# EAGLE schematic PMS alpha_v0.1 (EAGLE 9.0.1)

## Sheet 1 of 4
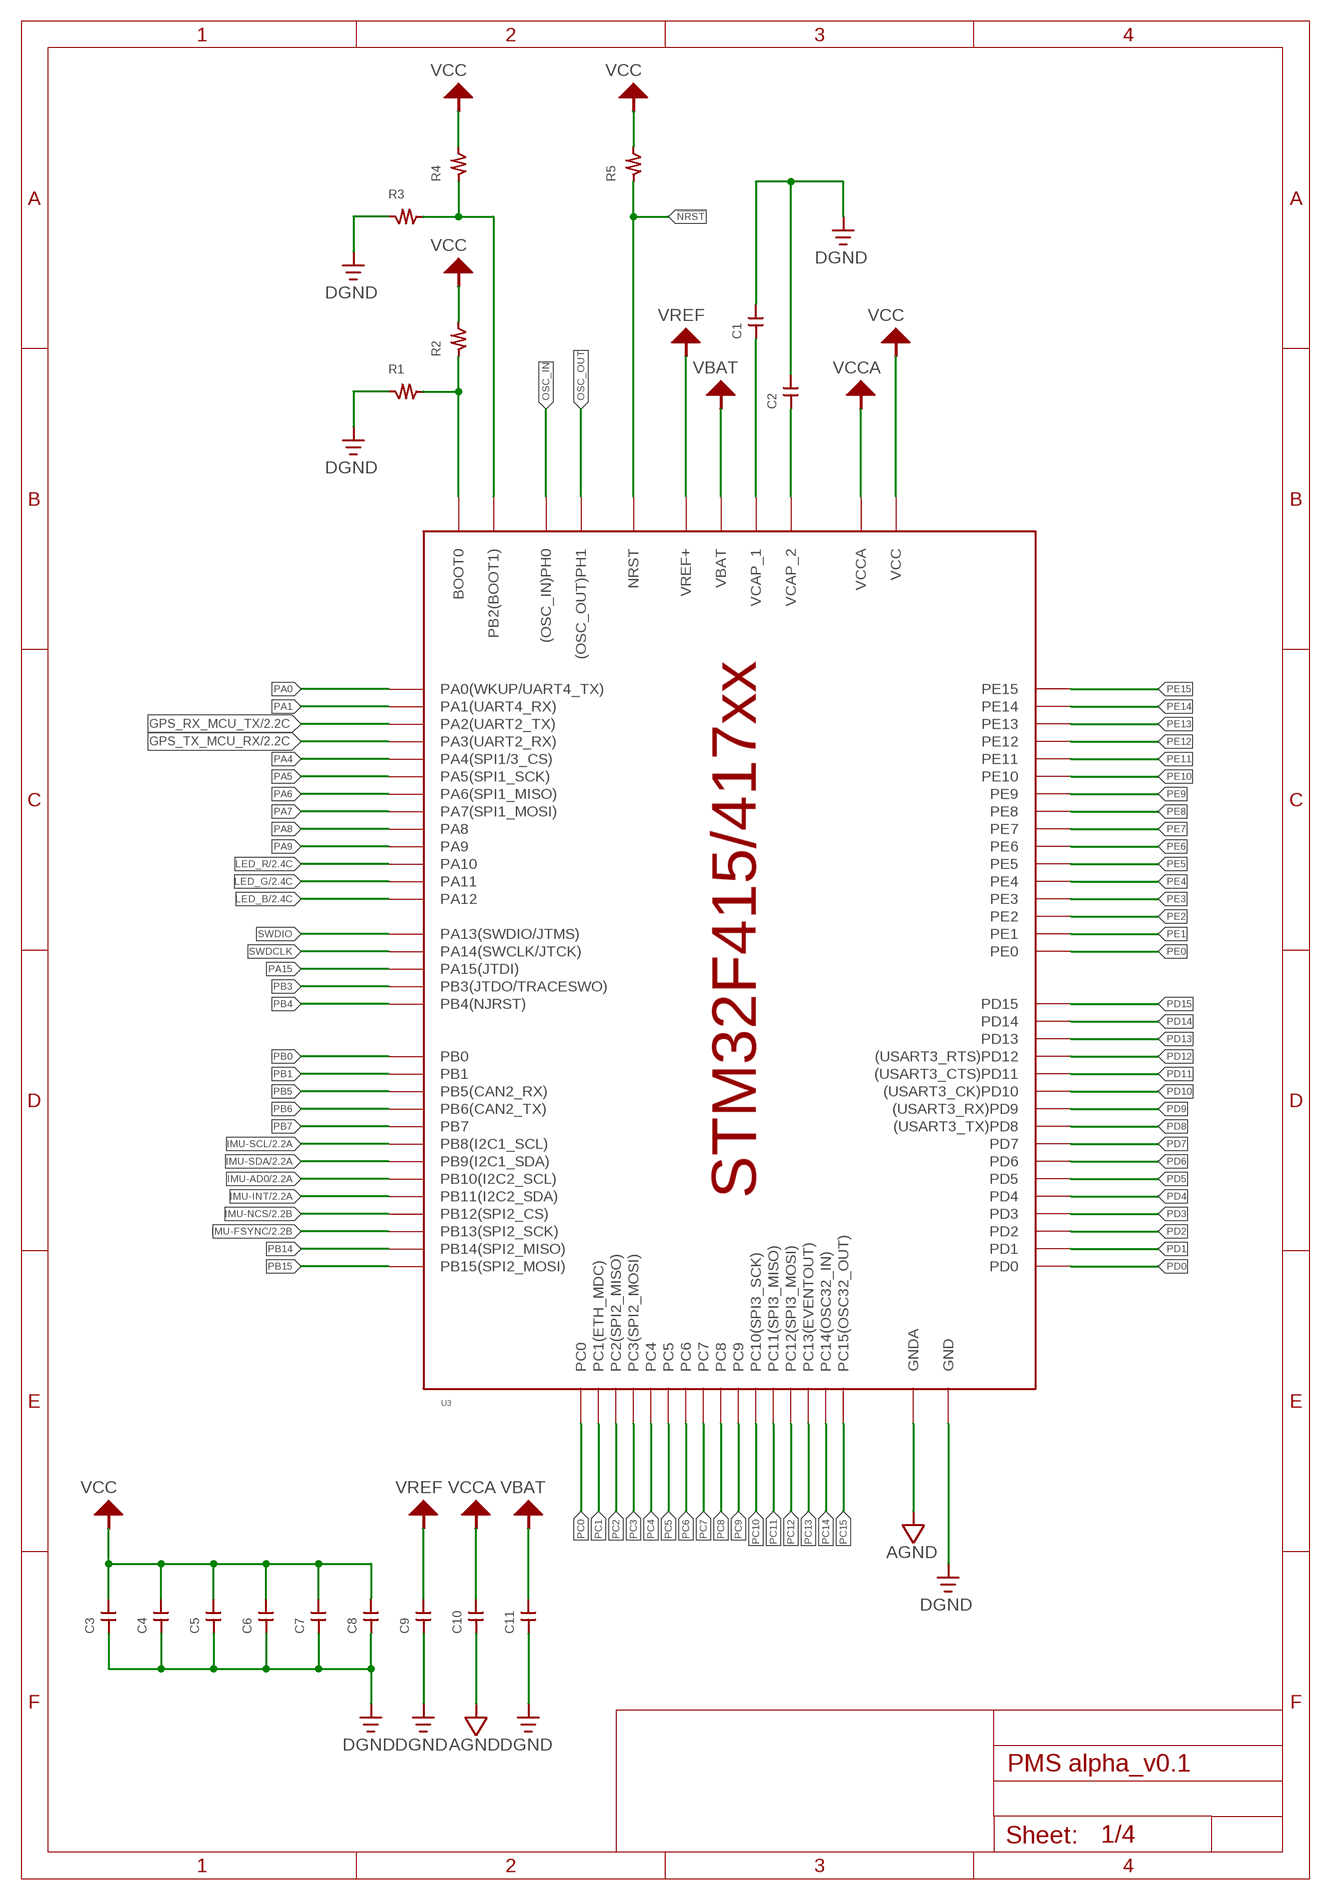
[diagram p0: schematic, sheet 1]

### Parts
C1  CAPACITOR_CHIP2012  [2012]
C2  CAPACITOR_CHIP2012  [2012]
C3  CAPACITOR_CHIP2012  [2012]
C4  CAPACITOR_CHIP2012  [2012]
C5  CAPACITOR_CHIP2012  [2012]
C6  CAPACITOR_CHIP2012  [2012]
C7  CAPACITOR_CHIP2012  [2012]
C8  CAPACITOR_CHIP2012  [2012]
C9  CAPACITOR_CHIP2012  [2012]
C10  CAPACITOR_CHIP2012  [2012]
C11  CAPACITOR_CHIP2012  [2012]
R1  RESISTOR_CHIP_2012  [2012]
R2  RESISTOR_CHIP_2012  [2012]
R3  RESISTOR_CHIP_2012  [2012]
R4  RESISTOR_CHIP_2012  [2012]
R5  RESISTOR_CHIP_2012  [2012]
U3  STM32F415/417  [LQFP100]

### Nets
!NRST: R5.P$1 U3.P$14(NRST)
AGND: C10.P$1 U3.P$20(GNDA)
BOOT0: R1.P$2 R2.P$1 U3.P$94(BOOT0)
BOOT1: R3.P$2 R4.P$1 U3.P$37(PB2(BOOT1))
DGND: C1.P$2 C2.P$2 C3.P$1 C4.P$1 C5.P$1 C6.P$1 C7.P$1 C8.P$1 C9.P$1 C11.P$1 R1.P$1 R3.P$1 U3.P$10(GND) U3.P$27(GND) U3.P$74(GND) U3.P$99(GND) ; also sheet 2,3
GPS_RX_MCU_TX: U3.P$25(PA2(UART2_TX)) ; also sheet 2
GPS_TX_MCU_RX: U3.P$26(PA3(UART2_RX)) ; also sheet 2
IMU-AD0: U3.P$47(PB10(I2C2_SCL)) ; also sheet 2
IMU-FSYNC: U3.P$52(PB13(SPI2_SCK)) ; also sheet 2
IMU-INT: U3.P$48(PB11(I2C2_SDA)) ; also sheet 2
IMU-NCS: U3.P$51(PB12(SPI2_CS)) ; also sheet 2
IMU-SCL: U3.P$95(PB8(I2C1_SCL)) ; also sheet 2
IMU-SDA: U3.P$96(PB9(I2C1_SDA)) ; also sheet 2
LED_B: U3.P$71(PA12) ; also sheet 2
LED_G: U3.P$70(PA11) ; also sheet 2
LED_R: U3.P$69(PA10) ; also sheet 2
OSC_IN: U3.P$12((OSC_IN)PH0)
OSC_OUT: U3.P$13((OSC_OUT)PH1)
PA0: U3.P$23(PA0(WKUP/UART4_TX))
PA1: U3.P$24(PA1(UART4_RX))
PA4: U3.P$29(PA4(SPI1/3_CS))
PA5: U3.P$30(PA5(SPI1_SCK))
PA6: U3.P$31(PA6(SPI1_MISO))
PA7: U3.P$32(PA7(SPI1_MOSI))
PA8: U3.P$67(PA8)
PA9: U3.P$68(PA9)
PA15: U3.P$77(PA15(JTDI))
PB0: U3.P$35(PB0)
PB1: U3.P$36(PB1)
PB3: U3.P$89(PB3(JTDO/TRACESWO))
PB4: U3.P$90(PB4(NJRST))
PB5: U3.P$91(PB5(CAN2_RX))
PB6: U3.P$92(PB6(CAN2_TX))
PB7: U3.P$93(PB7)
PB14: U3.P$53(PB14(SPI2_MISO))
PB15: U3.P$54(PB15(SPI2_MOSI))
PC0: U3.P$15(PC0)
PC1: U3.P$16(PC1(ETH_MDC))
PC2: U3.P$17(PC2(SPI2_MISO))
PC3: U3.P$18(PC3(SPI2_MOSI))
PC4: U3.P$33(PC4)
PC5: U3.P$34(PC5)
PC6: U3.P$63(PC6)
PC7: U3.P$64(PC7)
PC8: U3.P$65(PC8)
PC9: U3.P$66(PC9)
PC10: U3.P$78(PC10(SPI3_SCK))
PC11: U3.P$79(PC11(SPI3_MISO))
PC12: U3.P$80(PC12(SPI3_MOSI))
PC13: U3.P$7(PC13(EVENTOUT))
PC14: U3.P$8(PC14(OSC32_IN))
PC15: U3.P$9(PC15(OSC32_OUT))
PD0: U3.P$81(PD0)
PD1: U3.P$82(PD1)
PD2: U3.P$83(PD2)
PD3: U3.P$84(PD3)
PD4: U3.P$85(PD4)
PD5: U3.P$86(PD5)
PD6: U3.P$87(PD6)
PD7: U3.P$88(PD7)
PD8: U3.P$55((USART3_TX)PD8)
PD9: U3.P$56((USART3_RX)PD9)
PD10: U3.P$57((USART3_CK)PD10)
PD11: U3.P$58((USART3_CTS)PD11)
PD12: U3.P$59((USART3_RTS)PD12)
PD13: U3.P$60(PD13)
PD14: U3.P$61(PD14)
PD15: U3.P$62(PD15)
PE0: U3.P$97(PE0)
PE1: U3.P$98(PE1)
PE2: U3.P$1(PE2)
PE3: U3.P$2(PE3)
PE4: U3.P$3(PE4)
PE5: U3.P$4(PE5)
PE6: U3.P$5(PE6)
PE7: U3.P$38(PE7)
PE8: U3.P$39(PE8)
PE9: U3.P$40(PE9)
PE10: U3.P$41(PE10)
PE11: U3.P$42(PE11)
PE12: U3.P$43(PE12)
PE13: U3.P$44(PE13)
PE14: U3.P$45(PE14)
PE15: U3.P$46(PE15)
SWDCLK: U3.P$76(PA14(SWCLK/JTCK))
SWDIO: U3.P$72(PA13(SWDIO/JTMS))
VBAT: C11.P$2 U3.P$6(VBAT)
VCAP1: C1.P$1 U3.P$49(VCAP_1)
VCAP2: C2.P$1 U3.P$73(VCAP_2)
VCC_3.3V: C3.P$2 C4.P$2 C5.P$2 C6.P$2 C7.P$2 C8.P$2 R2.P$2 R4.P$2 R5.P$2 U3.P$11(VCC) U3.P$19(VCC) U3.P$28(VCC) U3.P$50(VCC) U3.P$75(VCC) U3.P$100(VCC) ; supply symbol labelled VCC ; also sheet 2
VCCA: C10.P$2 U3.P$22(VCCA)
VREF: C9.P$2 U3.P$21(VREF+)

## Sheet 2 of 4
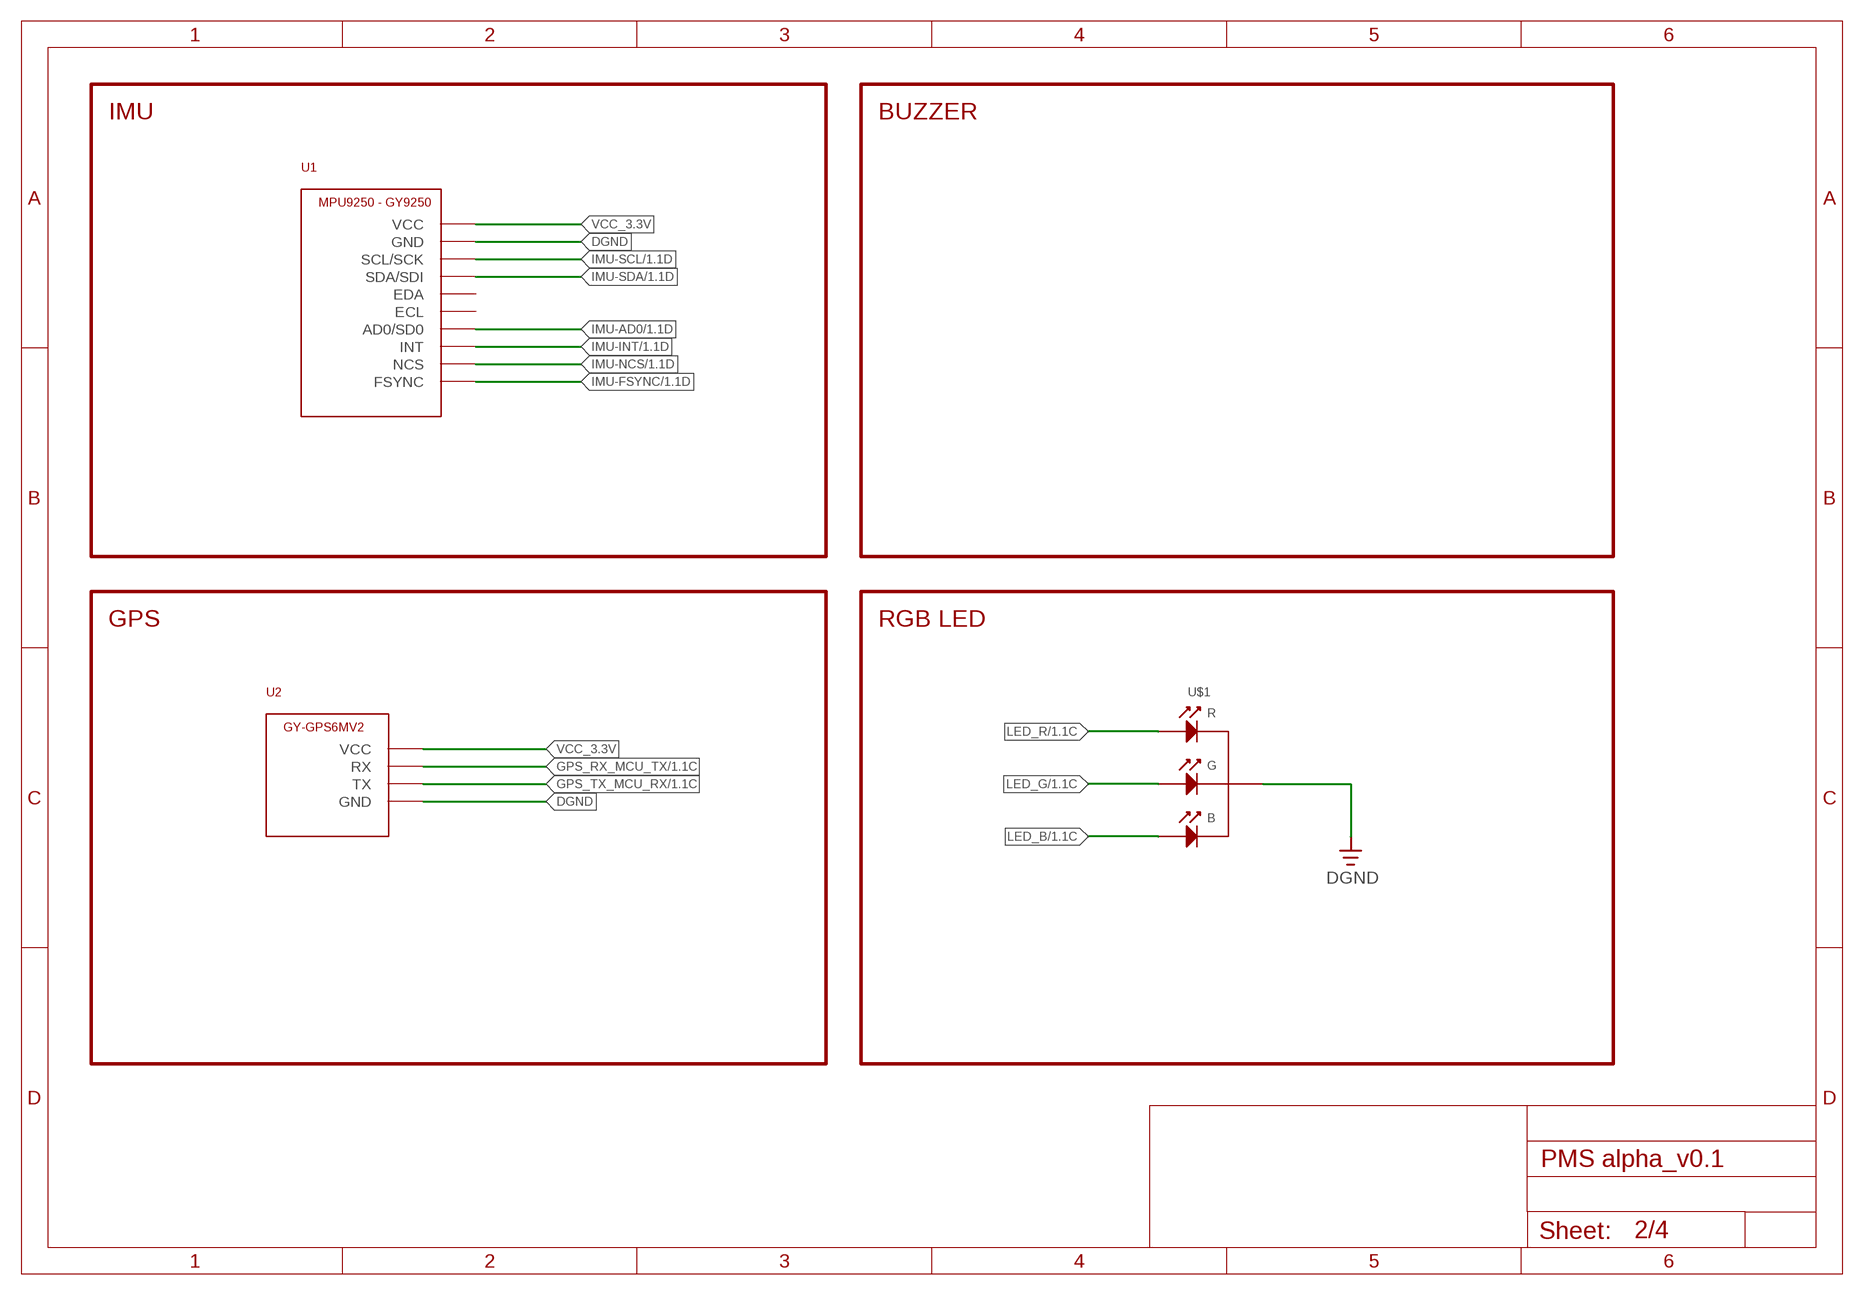
[diagram p1: schematic, sheet 2]

### Parts
U1  MPU-9250  [GY-9250]
U2  GPS6MV2  [PAD_2.5MM]
U$1  RGB_COM_K  [RGB_4PIN_2.5MM]

### Nets
DGND: U1.P$2(GND) U2.P$4(GND) U$1.P$4(K) ; also sheet 1,3
GPS_RX_MCU_TX: U2.P$2(RX) ; also sheet 1
GPS_TX_MCU_RX: U2.P$3(TX) ; also sheet 1
IMU-AD0: U1.P$7(AD0/SD0) ; also sheet 1
IMU-FSYNC: U1.P$10(FSYNC) ; also sheet 1
IMU-INT: U1.P$8(INT) ; also sheet 1
IMU-NCS: U1.P$9(NCS) ; also sheet 1
IMU-SCL: U1.P$3(SCL/SCK) ; also sheet 1
IMU-SDA: U1.P$4(SDA/SDI) ; also sheet 1
LED_B: U$1.P$3(A) ; also sheet 1
LED_G: U$1.P$2(A) ; also sheet 1
LED_R: U$1.P$1(A) ; also sheet 1
VCC_3.3V: U1.P$1(VCC) U2.P$1(VCC) ; also sheet 1
Unconnected: U1.P$5(EDA) U1.P$6(ECL)

### Notes on the sheet
- IMU | BUZZER
- GPS | RGB LED

## Sheet 3 of 4
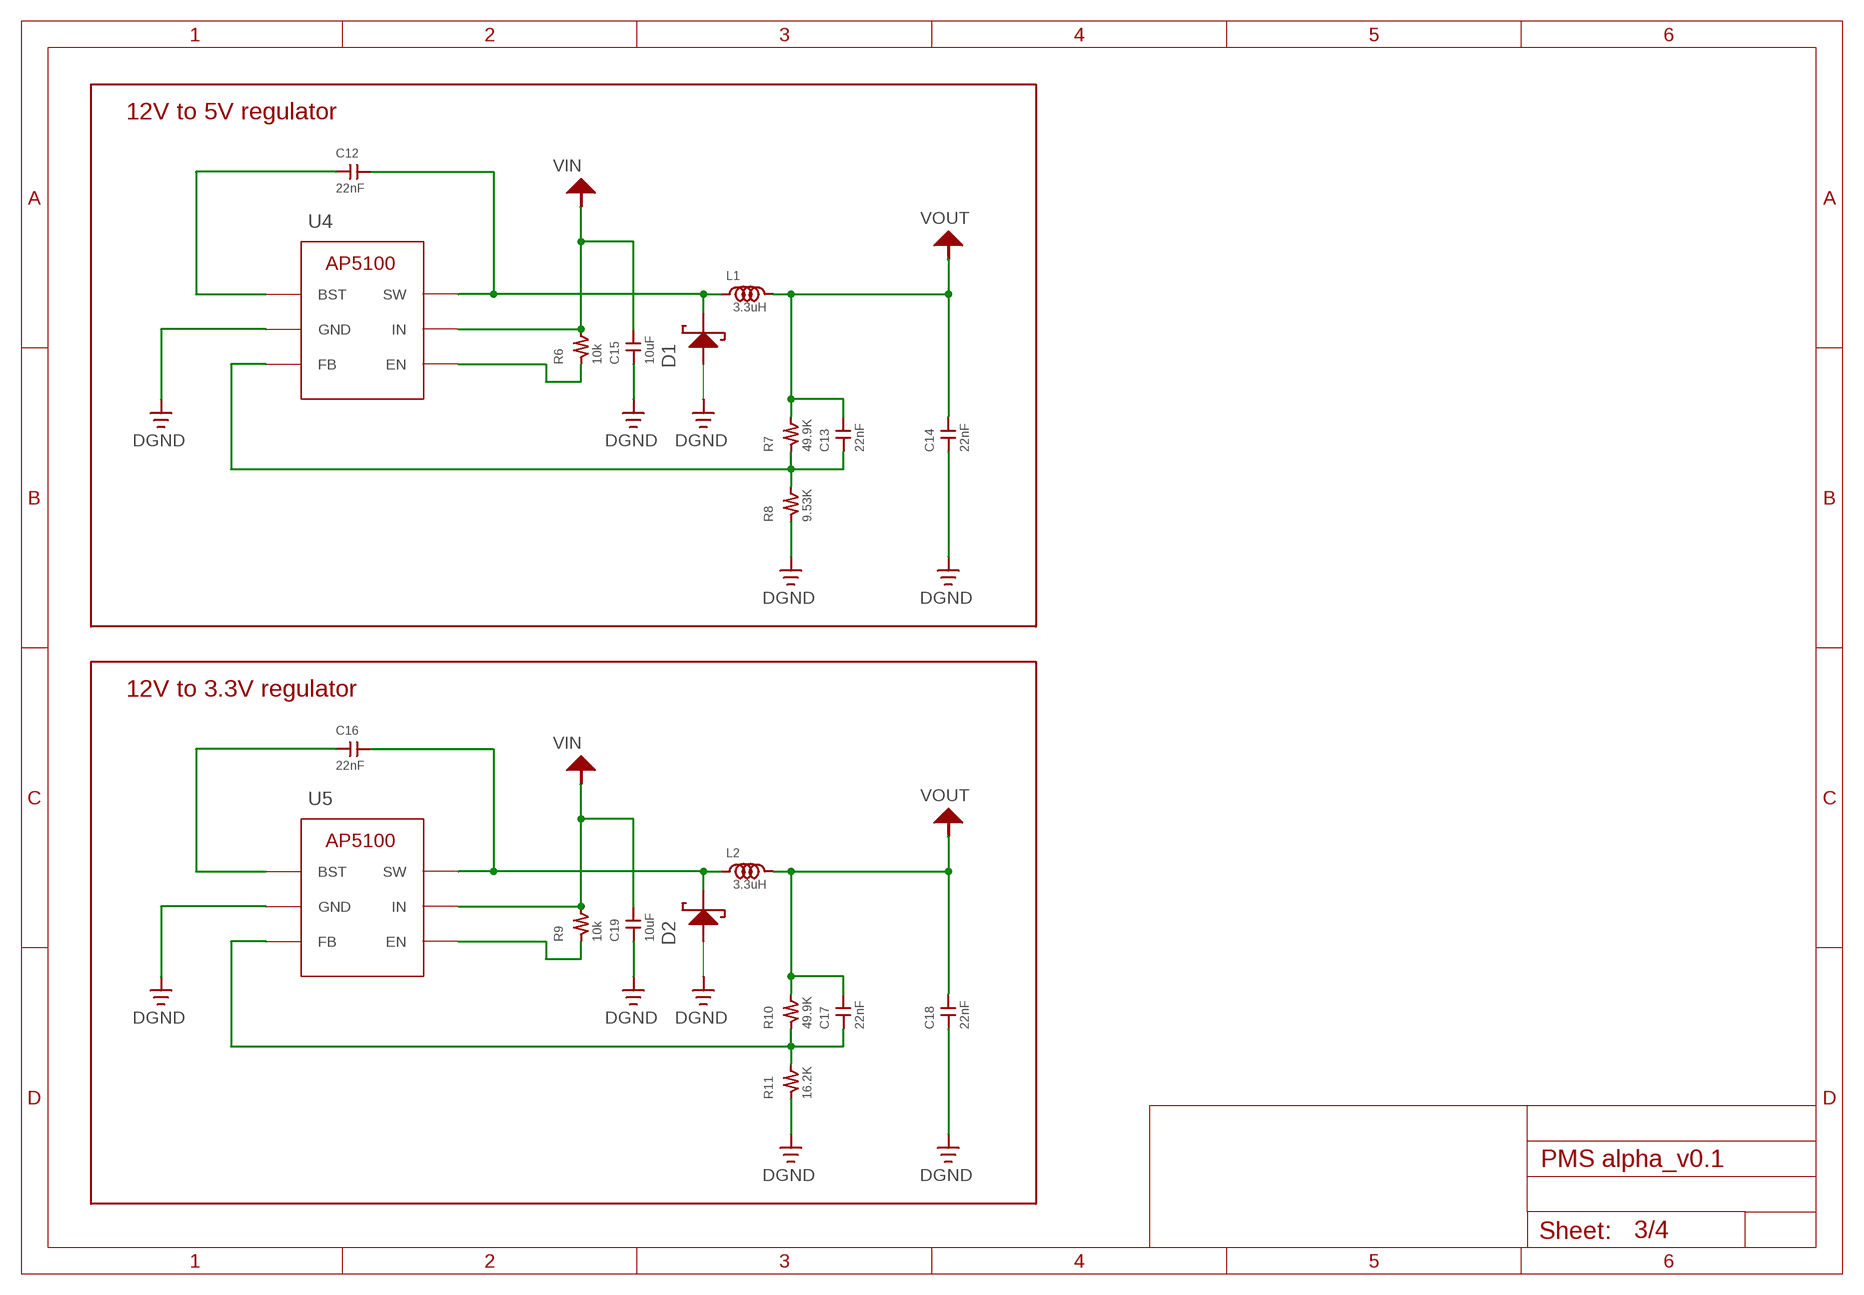
[diagram p2: schematic, sheet 3]

### Parts
C12  22nF  CAPACITOR_CHIP2012  [2012]
C13  22nF  CAPACITOR_CHIP2012  [2012]
C14  22nF  CAPACITOR_CHIP2012  [2012]
C15  10uF  CAPACITOR_CHIP2012  [2012]
C16  22nF  CAPACITOR_CHIP2012  [2012]
C17  22nF  CAPACITOR_CHIP2012  [2012]
C18  22nF  CAPACITOR_CHIP2012  [2012]
C19  10uF  CAPACITOR_CHIP2012  [2012]
D1  BAT60JFILM  [SOD323]
D2  BAT60JFILM  [SOD323]
L1  3.3uH  INDUCTOR2012  [2012]
L2  3.3uH  INDUCTOR2012  [2012]
R6  10k  RESISTOR_CHIP_2012  [2012]
R7  49.9K  RESISTOR_CHIP_2012  [2012]
R8  9.53K  RESISTOR_CHIP_2012  [2012]
R9  10k  RESISTOR_CHIP_2012  [2012]
R10  49.9K  RESISTOR_CHIP_2012  [2012]
R11  16.2K  RESISTOR_CHIP_2012  [2012]
U4  AP5100  [SOT-26]
U5  AP5100  [SOT-26]

### Nets
BST: C12.P$1 U4.P1(BST)
BST1: C16.P$1 U5.P1(BST)
DGND: C14.P$1 C15.P$1 C18.P$1 C19.P$1 D1.A D2.A R8.P$1 R11.P$1 U4.P2(GND) U5.P2(GND) ; also sheet 1,2
EN: R6.P$1 U4.P4(EN)
EN1: R9.P$1 U5.P4(EN)
FB: C13.P$1 R7.P$1 R8.P$2 U4.P3(FB)
FB1: C17.P$1 R10.P$1 R11.P$2 U5.P3(FB)
SW: C12.P$2 D1.K L1.P$1 U4.P6(SW)
SW1: C16.P$2 D2.K L2.P$1 U5.P6(SW)
VIN: C15.P$2 C19.P$2 R6.P$2 R9.P$2 U4.P5(IN) U5.P5(IN)
VOUT: C13.P$2 C14.P$2 C17.P$2 C18.P$2 L1.P$2 L2.P$2 R7.P$2 R10.P$2

### Notes on the sheet
- 12V to 5V regulator
- 12V to 3.3V regulator

## Sheet 4 of 4
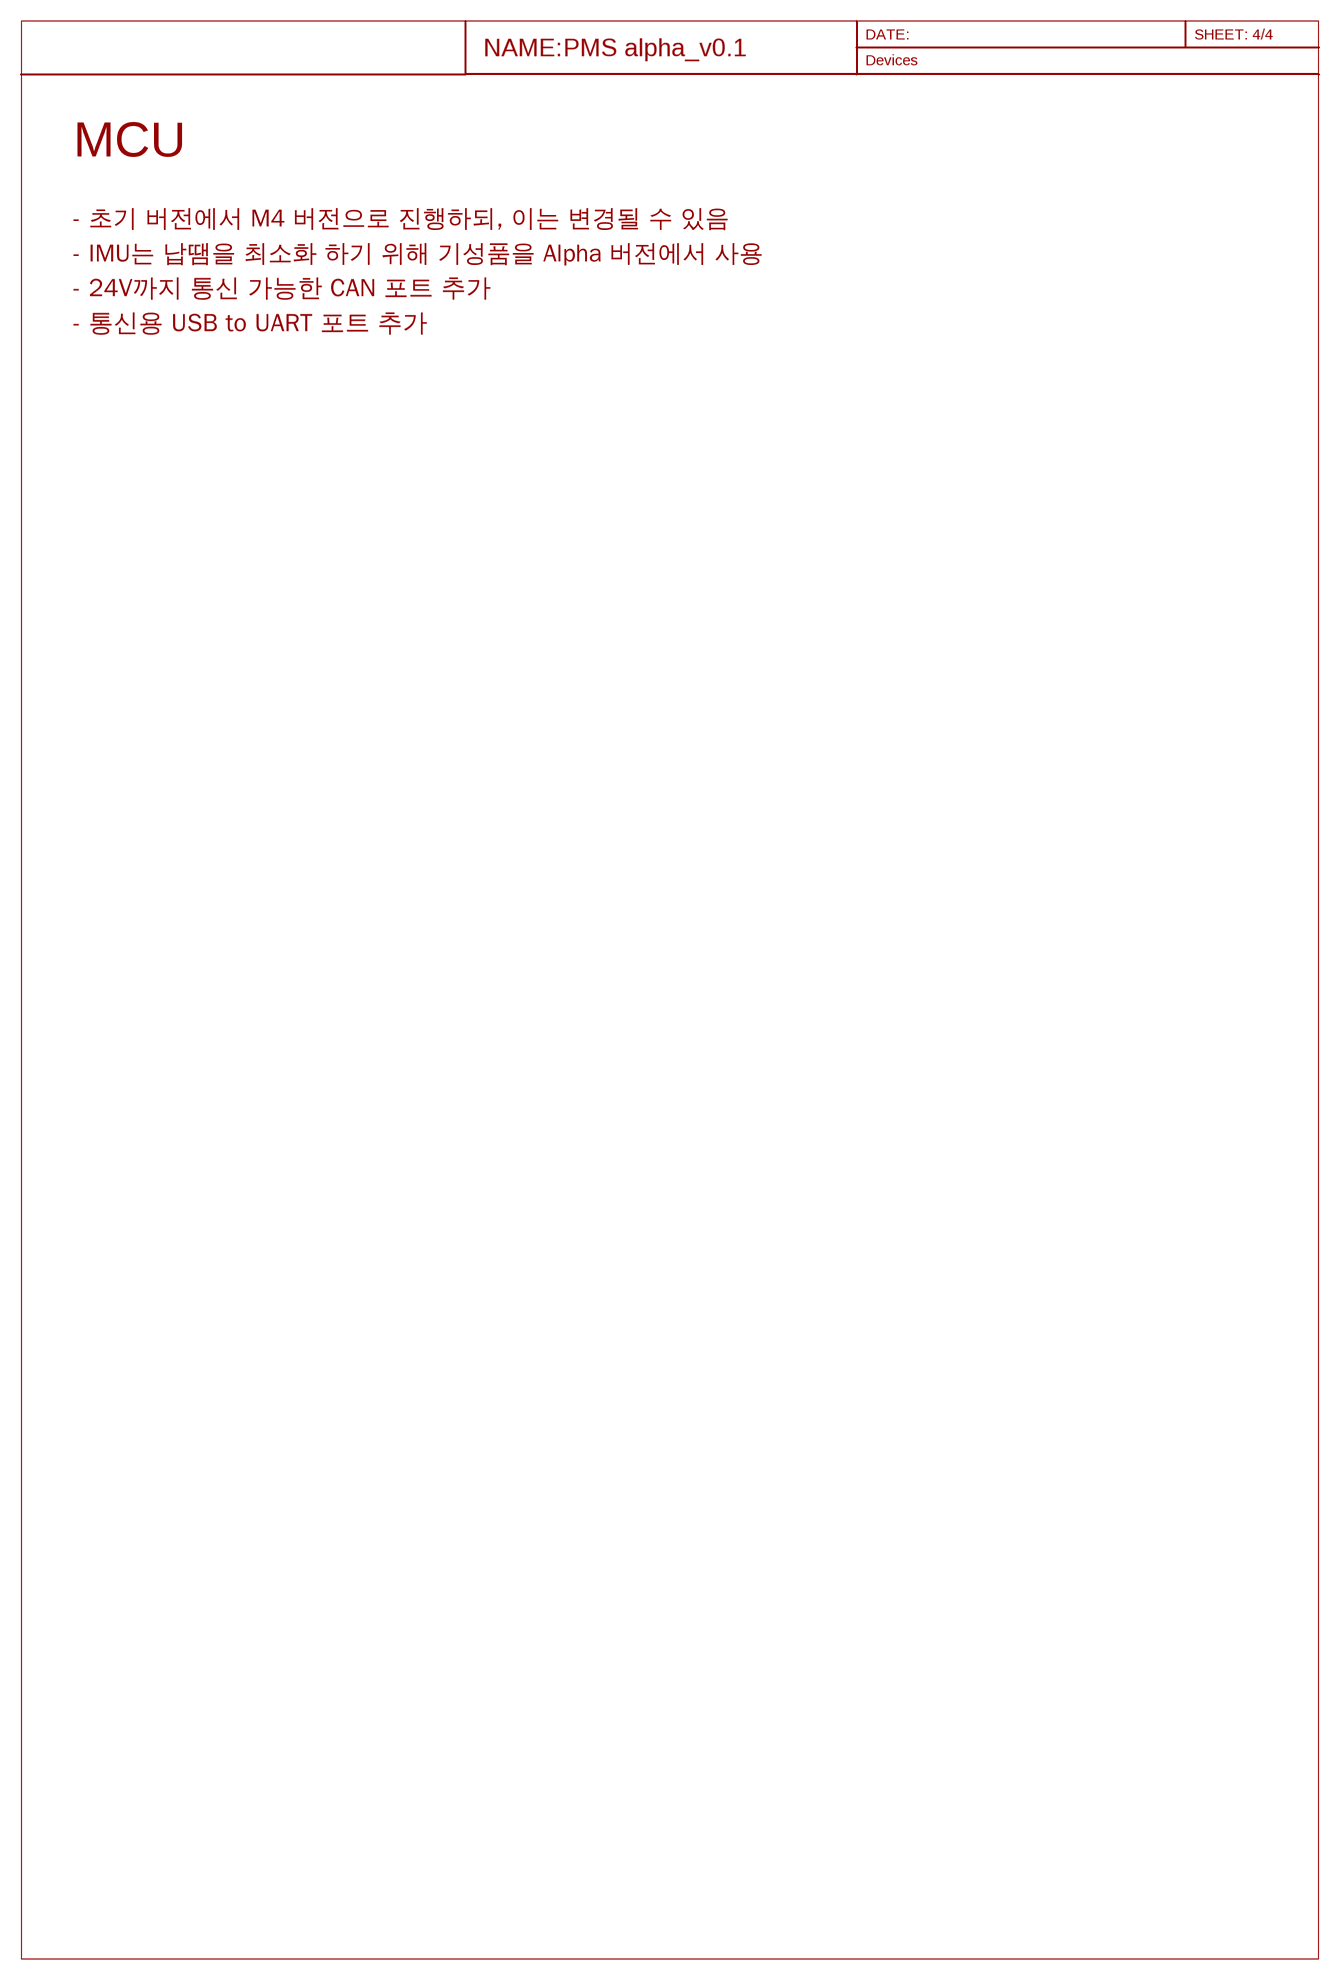
[diagram p3: schematic, sheet 4]

### Notes on the sheet
- MCU
- - 초기 버전에서 M4 버전으로 진행하되, 이는 변경될 수 있음
- - IMU는 납땜을 최소화 하기 위해 기성품을 Alpha 버전에서 사용
- - 24V까지 통신 가능한 CAN 포트 추가
- - 통신용 USB to UART 포트 추가

## Library data of the parts
C1-C19 = passive:CAPACITOR_CHIP
D1 D2 = Diode:BAT60: BAT60 is Schottky barrier diode encapsulated in a SOD-323 small SMD package. This device is intended for use in portable equipments. It is suited for DC to DC converters, step-up conversion and power management.
L1 L2 = passive:INDUCTOR
R1-R11 = passive:RESISTOR_CHIP_
U1 = MPU-9250:MPU-9250
U2 = GPS:GPS6MV2
U3 = ST-MCU:STM32F415/417
U4 U5 = Regulator:AP5100: The AP5100 is a current mode step-down converter with a built-in power MOSFET to enable smallest solution size power conversion. With the low series resistance power switch it enables a constant output current of up to 1.2A over a wide input supply range. The load and line regulation has excellent response time over the operating input voltage and temperature range. The AP5100 is self protected, through a cycle-by-cycle current limiting algorithm and an on chip thermal protection. The AP5100 will provide the voltage conversion with a low count of widely available standard external components. The AP5100 is available in SOT26 package.
U$1 = LED:RGB_COM_K